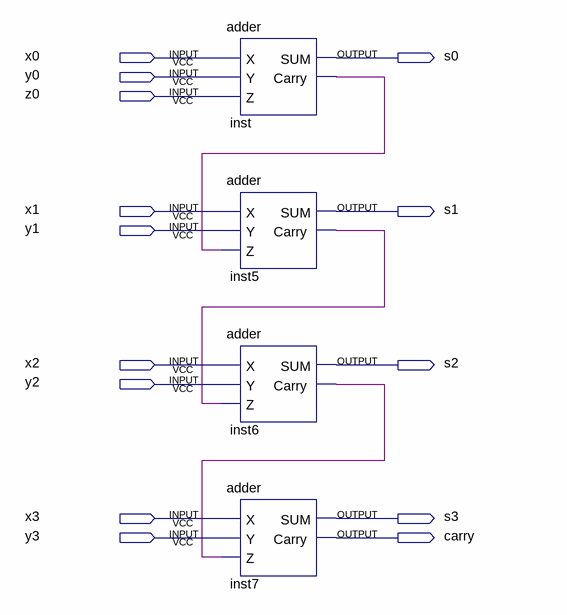
[diagram p0: schematic sheet]
// Quartus schematic adder_4bit.bdf as structural Verilog: 4 symbols, 14 pins
module adder_4bit (
  input  x0,
  input  y0,
  input  z0,
  input  x1,
  input  y1,
  input  x2,
  input  y2,
  input  x3,
  input  y3,
  output s0,
  output s1,
  output s2,
  output s3,
  output carry
);

  wire inst5_carry, inst6_carry, inst_carry;

  adder inst (.X(x0), .Y(y0), .Z(z0), .SUM(s0), .Carry(inst_carry));
  adder inst5 (.X(x1), .Y(y1), .Z(inst_carry), .SUM(s1), .Carry(inst5_carry));
  adder inst6 (.X(x2), .Y(y2), .Z(inst5_carry), .SUM(s2), .Carry(inst6_carry));
  adder inst7 (.X(x3), .Y(y3), .Z(inst6_carry), .SUM(s3), .Carry(carry));
endmodule
